# Altium project DE-120418.PrjPcb
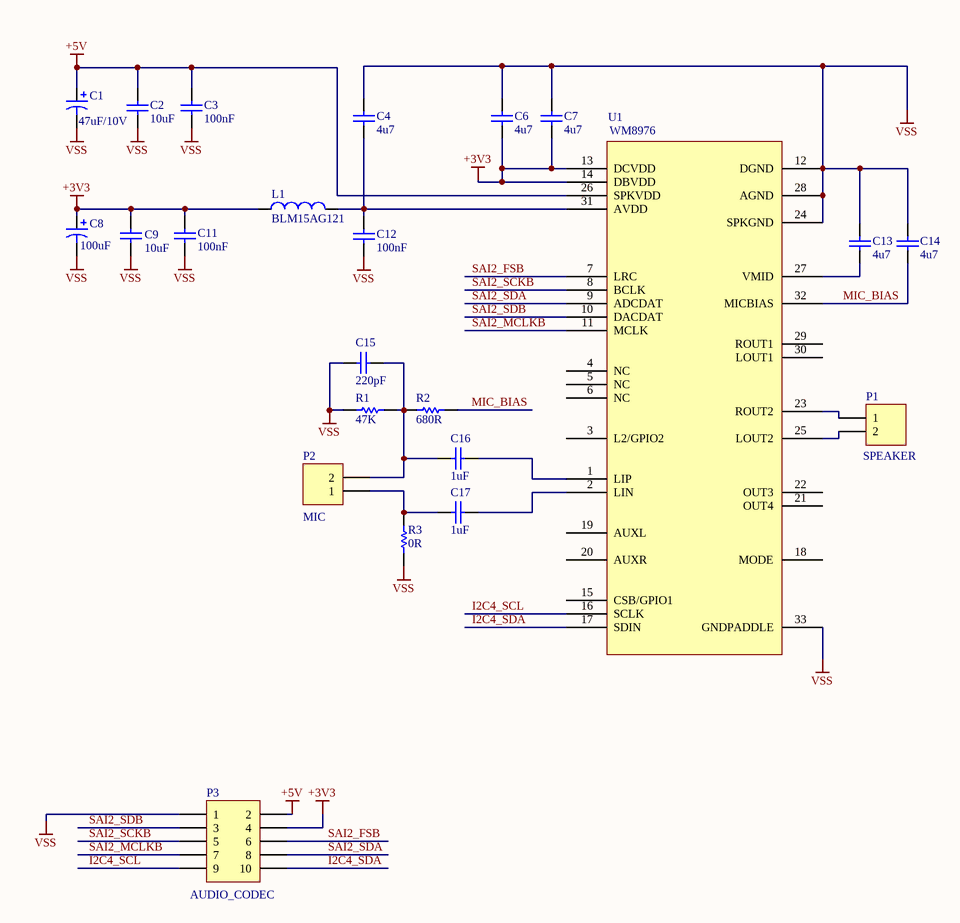
[diagram p0: DE-120418.SchDoc]
1 sheet, 23 parts. Net scope: global (net labels, ports and power ports of the same name join across sheets).
Board file: DE-120418.PcbDoc

## Sheet DE-120418.SchDoc: AUDIO CODEC
size A4; Author: eldar6776@hotmail.com; DrawnBy: Eldar Dedic; Organization: I-MEDIA GROUP d.o.o.; Address1: Topal Osman Paše 18; Address2: Sarajevo 71000; Address3: Federacija BiH; Address4: Bosna i Hercegovina; DocumentNumber: DE-120418; Revision: 001

### Parts
C1  47uF/10V  [3528]
C2  10uF  [0805]
C3  100nF  [0603]
C4  4u7  [0805]
C6  4u7  [0805]
C7  4u7  [0805]
C8  100uF  [3528]
C9  10uF  [0805]
C11  100nF  [0603]
C12  100nF  [0603]
C13  4u7  [0805]
C14  4u7  [0805]
C15  220pF  [0603]
C16  1uF  [0603]
C17  1uF  [0603]
L1  BLM15AG121  [INDC1608L]
P1  SPEAKER  [HDR1X2]
P2  MIC  [HDR1X2]
P3  AUDIO_CODEC  [HDR2X5]
R1  47K  [ERA-0603]
R2  680R  [ERA-0603]
R3  0R  [ERA-0603]
U1  WM8976  [QFN32_N]

### Nets
+3V3: C6.2 C7.2 C8.1 C9.2 C11.2 L1.1 P3.4 U1.13(DCVDD) U1.14(DBVDD)
+5V: C1.1 C2.2 C3.2 P3.2 U1.26(SPKVDD)
VSS: C1.2 C2.1 C3.1 C4.1 C6.1 C7.1 C8.2 C9.1 C11.1 C12.1 C13.1 C14.1 C15.1 P3.1 R1.2 R3.1 U1.12(DGND) U1.24(SPKGND) U1.28(AGND) U1.33(GNDPADDLE)
I2C4_SCL: P3.9 U1.16(SCLK)
I2C4_SDA: P3.10 U1.17(SDIN)
MIC_BIAS: C14.2 R2.1 U1.32(MICBIAS)
SAI2_FSB: P3.6 U1.7(LRC)
SAI2_MCLKB: P3.7 U1.11(MCLK)
SAI2_SCKB: P3.5 U1.8(BCLK)
SAI2_SDA: P3.8 U1.9(ADCDAT)
SAI2_SDB: P3.3 U1.10(DACDAT)
NetC4_2: C4.2 C12.2 L1.2 U1.31(AVDD)
NetC13_2: C13.2 U1.27(VMID)
NetC15_2: C15.2 C16.1 P2.2 R1.1 R2.2
NetC16_2: C16.2 U1.1(LIP)
NetC17_1: C17.1 P2.1 R3.2
NetC17_2: C17.2 U1.2(LIN)
NetP1_1: P1.1 U1.23(ROUT2)
NetP1_2: P1.2 U1.25(LOUT2)

Not connected (* = marked no-connect by the designer): U1 3(L2/GPIO2) 4(NC) 5(NC) 6(NC) 15(CSB/GPIO1) 18(MODE) 19(AUXL) 20(AUXR) 21(OUT4) 22(OUT3) 29(ROUT1) 30(LOUT1)

### Notes on the sheet
- Title
- Size:
- Date:
- A4
- Number:
- Time:
- Revision:
- Sheet
- of
- File:

### Library data of the parts
C1 = 293D156X0004B2: Tantamount Commercial, Surface Mount Solid Tantalum Chip Capacitor: 15uF, 20% Tolerance, 4 WVDC @ +85°C, Surge = 5.2V; Note: See Data Sheet for full range of components; Published: 19-Mar-2004; DatasheetDocument: 05-Feb-2003; PackageReference: 3528; Publisher: Altium Limited; Code_JEITA: 3528; ComponentLink1Description: Manufacturer Link; ComponentLink1URL: http://www.vishay.com/; ComponentLink2Description: Datasheet; ComponentLink2URL: http://www.vishay.com/docs/40002/293d.pdf; Value: 47uF/10V
C2 C4 C6 C7 C9 C13 C14 = C0805: Ceramic Chip Capacitor - Standard; Note: Footprint corresponds to dimensions for bulk cassette packaging. This case size has tightened tolerances.; Published: 17-Jul-2002; LatestRevisionDate: 19-Mar-2004; LatestRevisionNote: Silkscreen size reduced.; DatasheetDocument: Mar-2001; PackageDocument: Mar-2001; PackageReference: 0805; Publisher: Altium Limited; Code_JEITA: 0805; Code_IPC: 2012[0805]; ComponentLink1Description: Manufacturer Link; ComponentLink1URL: http://www.kemet.com/; ComponentLink2Description: Datasheet; ComponentLink2URL: http://www.kemet.com/kemet/web/homepage/kechome.nsf/vapubfilesname/F3102TA.pdf/$file/F3102TA.pdf
  C2 C9: Value: 10uF
  C4 C6 C7 C13 C14: Value: 4u7
C3 C11 C12 C16 C17 = C0603: Ceramic Chip Capacitor - Standard; Note: Footprint corresponds to dimensions for bulk cassette packaging. This case size has tightened tolerances.; Published: 17-Jul-2002; LatestRevisionDate: 19-Mar-2004; LatestRevisionNote: Silkscreen size reduced.; DatasheetDocument: Mar-2001; PackageDocument: Mar-2001; PackageReference: 0603; Publisher: Altium Limited; Code_JEITA: 0603; Code_IPC: 1608 [0603]; ComponentLink1Description: Manufacturer Link; ComponentLink1URL: http://www.kemet.com/; ComponentLink2Description: Datasheet; ComponentLink2URL: http://www.kemet.com/kemet/web/homepage/kechome.nsf/vapubfilesname/F3102TA.pdf/$file/F3102TA.pdf
  C3 C11 C12: Value: 100nF
  C16 C17: Value: 1uF
C8 = 293D156X0004B2: Tantamount Commercial, Surface Mount Solid Tantalum Chip Capacitor: 15uF, 20% Tolerance, 4 WVDC @ +85°C, Surge = 5.2V; Note: See Data Sheet for full range of components; Value: 100uF/6,3V; Published: 19-Mar-2004; DatasheetDocument: 05-Feb-2003; PackageReference: 3528; Publisher: Altium Limited; Code_JEITA: 3528; ComponentLink1Description: Manufacturer Link; ComponentLink1URL: http://www.vishay.com/; ComponentLink2Description: Datasheet; ComponentLink2URL: http://www.vishay.com/docs/40002/293d.pdf
C15 = C0603: Ceramic Chip Capacitor - Standard; Note: Footprint corresponds to dimensions for bulk cassette packaging. This case size has tightened tolerances.; Value: 100nF; Published: 17-Jul-2002; LatestRevisionDate: 19-Mar-2004; LatestRevisionNote: Silkscreen size reduced.; DatasheetDocument: Mar-2001; PackageDocument: Mar-2001; PackageReference: 0603; Publisher: Altium Limited; Code_JEITA: 0603; Code_IPC: 1608 [0603]; ComponentLink1Description: Manufacturer Link; ComponentLink1URL: http://www.kemet.com/; ComponentLink2Description: Datasheet; ComponentLink2URL: http://www.kemet.com/kemet/web/homepage/kechome.nsf/vapubfilesname/F3102TA.pdf/$file/F3102TA.pdf
L1 = Inductor_SMD: Inductor; Code_IEC: 1005; Published: 8-Jun-2000; LatestRevisionDate: 29-May-2009; LatestRevisionNote: IPC-7351 Footprint Added.; PackageReference: 0402-A; Publisher: Altium Limited; PackageDescription: Chip Inductor; Code_JEITA: 0402
P1 P2 = Header 2: Header, 2-Pin; LatestRevisionDate: 17-Jul-2002; LatestRevisionNote: Re-released for DXP Platform.; Publisher: Altium Limited
P3 = Header 5X2: Header, 5-Pin, Dual row; LatestRevisionDate: 17-Jul-2002; LatestRevisionNote: Re-released for DXP Platform.; Publisher: Altium Limited
R1-R3 = ERAV: Metal Film Thermosensitive Chip Resistor, 0.56 Ohm to 10k Ohm Range, 5% Tolerance, 0603 Size, 0.063 W; Note: If flow soldering, adjust pad width of PCB Footprint to 0.7 - 0.8 times the width of the resistor.; Value: 2K2; Published: 17-Dec-2003; LatestRevisionDate: 19-Mar-2004; LatestRevisionNote: Silkscreen size reduced.; PackageDocument: Mar-2003; PackageReference: ERA-0603; Publisher: Altium Limited; Code_IPC: 1608 [0603]; ComponentLink1Description: Manufacturer Link; ComponentLink1URL: http://www.panasonic.com/industrial/components/resistive_products.htm; ComponentLink2Description: Datasheet; ComponentLink2URL: http://www.panasonic.com/industrial/components/pdf/AOF0000CE1.pdf
U1 = WM8976: Stereo CODEC with speaker driver